# Altium project CathodeControl.PrjPcb
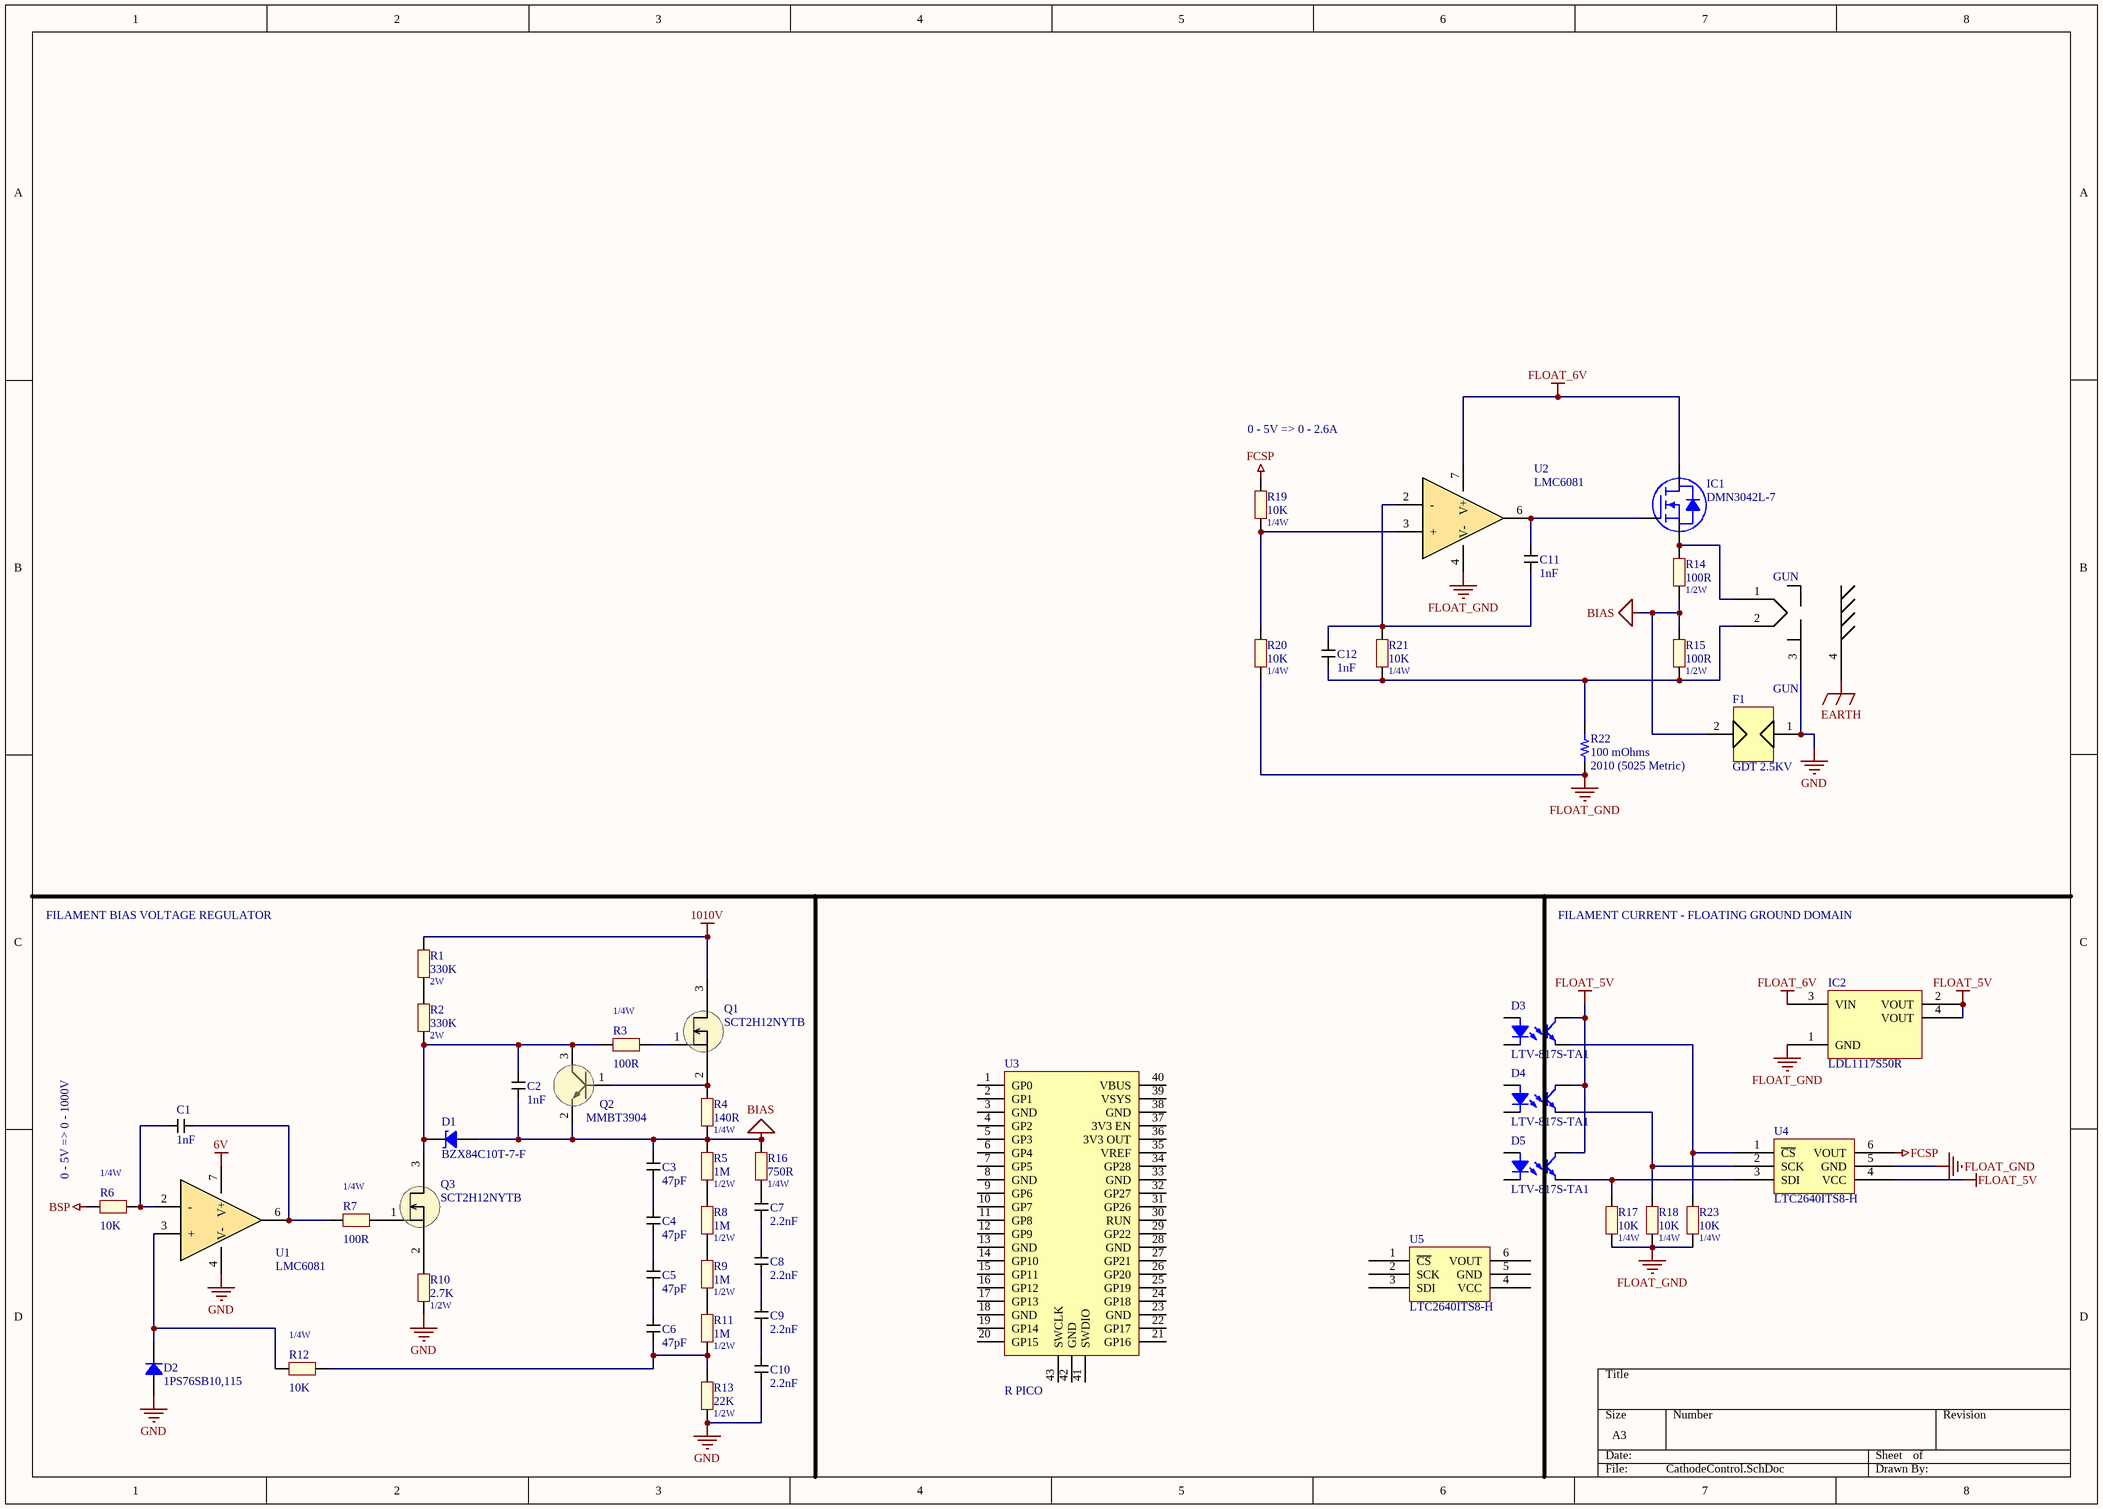
[diagram p0: CathodeControl.SchDoc]
2 sheets, 52 parts. Net scope: global (net labels, ports and power ports of the same name join across sheets).
Board file: CathodeControl.PcbDoc
Sheets:
  CathodeControl.SchDoc
  Simulation.SchDoc

## Sheet CathodeControl.SchDoc
size A3; SheetNumber: 1; SheetTotal: 2

### Parts
C1  1nF  [C0805]
C2  1nF  [C0805]
C3  47pF  [C0805]
C4  47pF  [C0805]
C5  47pF  [C0805]
C6  47pF  [C0805]
C7  2.2nF  [C0805]
C8  2.2nF  [C0805]
C9  2.2nF  [C0805]
C10  2.2nF  [C0805]
C11  1nF  [C0805]
C12  1nF  [C0805]
D1  BZX84C10T-7-F  [DIODES SOT-523]
D2  1PS76SB10,115  [SOD323]
D3  LTV-817S-TA1  [LITEON LTV-817]
D4  LTV-817S-TA1  [LITEON LTV-817]
D5  LTV-817S-TA1  [LITEON LTV-817]
F1  GDT 2.5KV  [GDT]
GUN  GUN
IC1  DMN3042L-7  [DIODES SOT-23-3]
IC2  LDL1117S50R  [ST SOT-223]
Q1  SCT2H12NYTB  [TO-268-2L]
Q2  MMBT3904  [SOT-23-3]
Q3  SCT2H12NYTB  [TO-268-2L]
R1  330K  Power: 2W  [R2512]
R2  330K  Power: 2W  [R2512]
R3  100R  Power: 1/4W  [R0805]
R4  140R  Power: 1/4W  [R0805]
R5  1M  Power: 1/2W  [R1206]
R6  10K  Power: 1/4W  [R0805]
R7  100R  Power: 1/4W  [R0805]
R8  1M  Power: 1/2W  [R1206]
R9  1M  Power: 1/2W  [R1206]
R10  2.7K  Power: 1/2W  [R1206]
R11  1M  Power: 1/2W  [R1206]
R12  10K  Power: 1/4W  [R0805]
R13  22K  Power: 1/2W  [R1206]
R14  100R  Power: 1/2W  [R1206]
R15  100R  Power: 1/2W  [R1206]
R16  750R  Power: 1/4W  [R0805]
R17  10K  Power: 1/4W  [R0805]
R18  10K  Power: 1/4W  [R0805]
R19  10K  Power: 1/4W  [R0805]
R20  10K  Power: 1/4W  [R0805]
R21  10K  Power: 1/4W  [R0805]
R22  100 mOhms  Package / Case: 2010 (5025 Metric)  [STACKPOLE CSR2010]
R23  10K  Power: 1/4W  [R0805]
U1  LMC6081  [SOIC-8]
U2  LMC6081  [SOIC-8]
U3  R PICO  [RPICO]
U4  LTC2640ITS8-H  [SC-70-6]
U5  LTC2640ITS8-H  [SC-70-6]

### Nets
6V: U1.7(V+)
1010V: Q1.3 R1.2
BIAS: C2.1 C3.2 D1.1 F1.2 Q2.2 R4.1 R5.2 R14.1 R15.2 R16.1
BSP: R6.2
EARTH: GUN.4
FCSP: R19.1 U4.6(VOUT)
FLOAT_5V: D3.4 D4.4 D5.4 IC2.2(VOUT) IC2.4(VOUT) U4.4(VCC)
FLOAT_6V: IC1.3(D) IC2.3(VIN) U2.7(V+)
FLOAT_GND: IC2.1(GND) R17.2 R18.2 R20.2 R22.1 R23.2 U2.4(V-) U4.5(GND)
GND: C10.1 D2.1 F1.1 GUN.3 R10.1 R13.1 U1.4(V-)
NetC1_1: C1.1 R7.2 U1.6
NetC1_2: C1.2 R6.1 U1.2(-)
NetC2_2: C2.2 D1.2 Q2.3 Q3.3 R2.1 R3.2
NetC3_1: C3.1 C4.2
NetC4_1: C4.1 C5.2
NetC5_1: C5.1 C6.2
NetC6_1: C6.1 R11.1 R12.1 R13.2
NetC7_1: C7.1 C8.2
NetC7_2: C7.2 R16.2
NetC8_1: C8.1 C9.2
NetC9_1: C9.1 C10.2
NetC11_1: C11.1 IC1.1(G) U2.6
NetC11_2: C11.2 C12.1 R21.1 U2.2(-)
NetC12_2: C12.2 GUN.2 R15.1 R21.2 R22.2
NetD2_2: D2.2 R12.2 U1.3(+)
NetD3_3: D3.3 R23.1 U4.1(~{CS})
NetD4_3: D4.3 R18.1 U4.2(SCK)
NetD5_3: D5.3 R17.1 U4.3(SDI)
NetGUN_1: GUN.1 IC1.2(S) R14.2
NetQ1_1: Q1.1 R3.1
NetQ1_2: Q1.2 Q2.1 R4.2
NetQ3_1: Q3.1 R7.1
NetQ3_2: Q3.2 R10.2
NetR1_1: R1.1 R2.2
NetR5_1: R5.1 R8.2
NetR8_1: R8.1 R9.2
NetR9_1: R9.1 R11.2
NetR19_2: R19.2 R20.1 U2.3(+)

Not connected (* = marked no-connect by the designer): D3 1 2; D4 1 2; D5 1 2; U3 1(GP0) 2(GP1) 3(GND) 4(GP2) 5(GP3) 6(GP4) 7(GP5) 8(GND) 9(GP6) 10(GP7) 11(GP8) 12(GP9) 13(GND) 14(GP10) 15(GP11) 16(GP12) 17(GP13) 18(GND) 19(GP14) 20(GP15) 21(GP16) 22(GP17) 23(GND) 24(GP18) 25(GP19) 26(GP20) 27(GP21) 28(GND) 29(GP22) 30(RUN) 31(GP26) 32(GP27) 33(GND) 34(GP28) 35(VREF) 36(3V3_OUT) 37(3V3_EN) 38(GND) 39(VSYS) 40(VBUS) 41(SWDIO) 42(GND) 43(SWCLK); U5 1(~{CS}) 2(SCK) 3(SDI) 4(VCC) 5(GND) 6(VOUT)

### Notes on the sheet
- 0 - 5V => 0 - 2.6A
- FILAMENT BIAS VOLTAGE REGULATOR
- FILAMENT CURRENT - FLOATING GROUND DOMAIN
- (near R6) 0 - 5V => 0 - 1000V

### Library data of the parts
C1 C2 C7-C12 = C0805
  C1 C2 C11 C12: Capacitance: 1nF
  C7-C10: Capacitance: 2.2nF
C3-C6 = 885342007006: 47 pF ±5% 500V Ceramic Capacitor C0G, NP0 0805 (2012 Metric); Capacitance: 47pF; Supplier 1: Digi-Key; Supplier Part Number 1: 732-12170-1-ND
D1 = BZX84C10T-7-F: DIODE ZENER 10V 150MW SOT523; Manufacturer: Diodes Incorporated; Current - Reverse Leakage @ Vr: 200 nA @ 7 V; Impedance (Max) (Zzt): 20 Ohms; Tolerance: ±6%; Voltage - Forward (Vf) (Max) @ If: 900 mV @ 10 mA; Part Number: BZX84C10T-7-F; ComponentLink1Description: Datasheet; ComponentLink1URL: https://www.diodes.com/assets/Datasheets/ds30262.pdf; ComponentLink2Description: DigiKey Link; ComponentLink2URL: https://www.digikey.com/en/products/detail/diodes-incorporated/BZX84C10T-7-F/1142229; LastUpdated: 4/12/2022 10:53:00 PM; Lifecycle Status: Active; Minimum Order: 1; Mounting Type: Surface Mount; Operating Temperature: -65°C ~ 150°C; Package / Case: SOT-523; Packaging: TapeAndReel; PartId: 778; Part Status: Active; Power - Max: 150 mW; Price: 0.05; Series: -; Supplier 1: DigiKey; Supplier Part Number 1: BZX84C10T-FDICT-ND; Supplier Device Package: SOT-523; Voltage - Zener (Nom) (Vz): 10 V
D2 = 1PS76SB10,115: DIODE SCHOTTKY 30V 200MA SOD323; Manufacturer: Nexperia USA Inc.; Capacitance @ Vr, F: 10pF @ 1V, 1MHz; Current - Average Rectified (Io): 200mA (DC); Current - Reverse Leakage @ Vr: 2 µA @ 25 V; Speed: Small Signal =< 200mA (Io), Any Speed; Voltage - Forward (Vf) (Max) @ If: 800 mV @ 100 mA; Part Number: 1PS76SB10,115; ComponentLink1Description: Datasheet; ComponentLink1URL: https://assets.nexperia.com/documents/data-sheet/1PS76SB10.PDF; ComponentLink2Description: DigiKey Link; ComponentLink2URL: https://www.digikey.com/en/products/detail/nexperia-usa-inc/1PS76SB10-115/1127159; Diode Type: Schottky; LastUpdated: 4/12/2022 11:03:32 PM; Lifecycle Status: Active; Minimum Order: 1; Mounting Type: Surface Mount; Operating Temperature - Junction: 125°C (Max); Package / Case: SC-76, SOD-323; Packaging: TapeAndReel; PartId: 2999; Part Status: Active; Price: 0.03; Series: Automotive, AEC-Q101; Supplier 1: DigiKey; Supplier Part Number 1: 1727-3561-1-ND; Supplier Device Package: SOD-323; Voltage - DC Reverse (Vr) (Max): 30 V
D3-D5 = LTV-817S-TA1: OPTOISOLATR 5KV TRANSISTOR 4-SMD; Manufacturer: Lite-On Inc.; Current - DC Forward (If) (Max): 50mA; Current Transfer Ratio (Max): 600% @ 5mA; Current Transfer Ratio (Min): 50% @ 5mA; Input Type: DC; Number of Channels: 1; Rise / Fall Time (Typ): 4µs, 3µs; Vce Saturation (Max): 200mV; Voltage - Forward (Vf) (Typ): 1.2V; Voltage - Isolation: 5000Vrms; Voltage - Output (Max): 35V; Part Number: LTV-817S-TA1; ComponentLink1Description: Datasheet; ComponentLink1URL: http://optoelectronics.liteon.com/upload/download/DS-70-96-0016/LTV-8X7%20series%20201610%20.pdf; ComponentLink2Description: DigiKey Link; ComponentLink2URL: http://digikey.com/product-detail/en/lite-on-inc/LTV-817S-TA1/160-1893-1-ND/3306757; Current - Output / Channel: 50mA; Device Package: 4-SMD, Gull Wing; LastUpdated: 1/12/2020 9:58:48 PM; Lifecycle Status: Active; Minimum Order: 1; Mounting Type: Surface Mount; Operating Temperature: -30°C ~ 110°C; Output Type: Transistor; Package / Case: 4-SMD, Gull Wing; Packaging: TapeAndReel; Part Status: Active; Price: 0.12; Series: -; Supplier 1: DigiKey; Supplier Part Number 1: 160-1893-1-ND; Supplier Device Package: 4-SMD
F1 = B88069X2500T502: Gas Discharge Tube 2500 V 2000A (2kA) ±20% 2 Pole Through Hole
IC1 = DMN3042L-7: MOSFET N-CH 30V 5.8A SOT23; Manufacturer: Diodes Incorporated; Current - Continuous Drain (Id) @ 25°C: 5.8A (Ta); Drive Voltage (Max Rds On,  Min Rds On): 2.5V, 10V; FET Type: N-Channel; Gate Charge (Qg) (Max) @ Vgs: 20 nC @ 10 V; Input Capacitance (Ciss) (Max) @ Vds: 860 pF @ 15 V; Power Dissipation (Max): 720mW (Ta); Rds On (Max) @ Id, Vgs: 26.5mOhm @ 5.8A, 10V; Vgs (Max): ±12V; Vgs(th) (Max) @ Id: 1.4V @ 250µA; Part Number: DMN3042L-7; ComponentLink1Description: Datasheet; ComponentLink1URL: https://www.diodes.com/assets/Datasheets/DMN3042L.pdf; ComponentLink2Description: DigiKey Link; ComponentLink2URL: https://www.digikey.com/en/products/detail/diodes-incorporated/DMN3042L-7/5223209; Drain to Source Voltage (Vdss): 30 V; LastUpdated: 4/12/2022 11:00:46 PM; Lifecycle Status: Active; Minimum Order: 1; Mounting Type: Surface Mount; Operating Temperature: -55°C ~ 150°C (TJ); Package / Case: TO-236-3, SC-59, SOT-23-3; Packaging: TapeAndReel; Part Status: Active; Price: 0.10; Series: -; Supplier 1: DigiKey; Supplier Part Number 1: DMN3042L-7DICT-ND; Supplier Device Package: SOT-23-3; Technology: MOSFET (Metal Oxide)
IC2 = LDL1117S50R: IC REG LINEAR 5V 1.2A SOT223; Manufacturer: STMicroelectronics; Current - Quiescent (Iq): 500µA; Number of Regulators: 1; Output Configuration: Positive; Output Type: Fixed; Protection Features: Over Current, Over Temperature, Under Voltage Lockout (UVLO); PSRR: 87dB ~ 65dB (120Hz ~ 100kHz); Voltage Dropout (Max): 0.6V @ 1.2A; Voltage - Input (Max): 18V; Part Number: LDL1117S50R; ComponentLink1Description: Datasheet; ComponentLink1URL: http://www.st.com/content/ccc/resource/technical/document/datasheet/group3/0e/5a/00/ca/10/1a/4f/a5/DM00366442/files/DM00366442.pdf/jcr:content/translations/en.DM00366442.pdf; ComponentLink2Description: DigiKey Link; ComponentLink2URL: http://digikey.com/product-detail/en/stmicroelectronics/LDL1117S50R/497-17240-1-ND/7102080; Current - Output: 1.2A; LastUpdated: 4/12/2022 11:08:41 PM; Lifecycle Status: Active; Minimum Order: 1; Mounting Type: Surface Mount; Operating Temperature: -40°C ~ 125°C (TJ); Package / Case: TO-261-4, TO-261AA; Packaging: TapeAndReel; Part Status: Active; Price: 0.12; Series: -; Supplier 1: DigiKey; Supplier Part Number 1: 497-17240-1-ND; Supplier Device Package: SOT-223; Voltage - Output (Min/Fixed): 5V
Q1 Q3 = SCT2H12NYTB: N-MOSFET 1700V 4A; Supplier 1: Digi-Key; Supplier Part Number 1: SCT2H12NYTBTR-ND
Q2 = MMBT3904_1: BIPOLAR NPN Transistor; Supplier 1: Mouser; Supplier 2: Digi-Key; Supplier Part Number 1: 863-MMBT3904LT1G; Supplier Part Number 2: MMBT3904LT1GOSDKR-ND
R1 R2 = R2W: Resistor 2W; Resistance: 330K
R3 R4 R6 R7 R12 R16-R21 R23 = R0.25W: Resistor 1/2W
  R3 R7: Resistance: 100R
  R4: Resistance: 140R
  R6 R12 R17-R21 R23: Resistance: 10K
  R16: Resistance: 750R
R5 R8-R11 R13-R15 = R0.5W: Resistor 1/2W
  R5 R8 R9 R11: Resistance: 1M
  R10: Resistance: 2.7K
  R13: Resistance: 22K
  R14 R15: Resistance: 100R
R22 = ERJ-B1CFR10U: RES 0.1 OHM 2W 2010 WIDE; Manufacturer: Panasonic Electronic Components; Temperature Coefficient: ±100ppm/°C; Tolerance: ±1%; Part Number: ERJ-B1CFR10U; ComponentLink1Description: Datasheet; ComponentLink1URL: http://industrial.panasonic.com/www-cgi/jvcr13pz.cgi?E+PZ+4+AOA0023+ERJB1CFR10U+8+WW; ComponentLink2Description: DigiKey Link; ComponentLink2URL: https://www.digikey.com/en/products/detail/panasonic-electronic-components/ERJ-B1CFR10U/2795283; Composition: Thick Film; Device Package: 2010 (5025 Metric); Features: Automotive AEC-Q200, Current Sense; Height - Seated (Max): 0.030" (0.75mm); LastUpdated: 4/12/2022 10:45:51 PM; Lifecycle Status: Active; Minimum Order: 1; Number of Terminations: 2; Operating Temperature: -55°C ~ 155°C; Packaging: TapeAndReel; PartId: 2967; Part Status: Active; Power (Watts): 2W; Price: 0.59; Ratings: AEC-Q200; Resistance: 100 mOhms; Series: ERJ-B1; Size / Dimension: 0.098" L x 0.197" W (2.50mm x 5.00mm); Supplier 1: DigiKey; Supplier Part Number 1: P18941CT-ND; Supplier Device Package: 1020; Value: 100 mOhms
U1 U2 = LMC6081: Low offset voltage: 150 μV Operates from 4.5V to 15V single supply Ultra low input bias current: 10 fA; Supplier 1: Digi-Key; Supplier Part Number 1: 296-35439-1-ND
U3 = RaspPico
U4 U5 = LTC2640ITS8-HZ12: Supplier 1: Digi-Key; Supplier Part Number 1: LTC2640ITS8-HZ12#TRMPBFCT-ND

## Sheet Simulation.SchDoc
size A; SheetNumber: 2; SheetTotal: 2; SPICEModelCacheDPPIMOKE: <root> / <DocumentId>DPPIMOKE</DocumentId> / <CacheFrame Number="0"> / <Model Name="block_dc_h1_lmc608x" Kind="CKT"> / <Text>* / .SUBCKT BLOCK_DC_H1_LMC608x 1 2 3 4 / H_H1         3 4 VH_H1 1K / VH_H1         1 2 0V / .ENDS  BLOCK_DC_H1_LMC608x</Text> / </Model> / <Model Name="clamp_amp_hi_lmc608x" Kind="CKT"> / <Text>* / .SUBCKT CLAMP_AMP_HI_LMC608x VC+ VC- VIN COM VO+ VO- PARAMS: G=10 / GVO+ COM VO+ VALUE = {IF(V(VIN,COM)&gt;V(VC+,COM),((V(VIN,COM)-V(VC+,COM))*G),0)} / GVO- COM VO- VALUE = {IF(V(VIN,COM)&lt;V(VC-,COM),((V(VC-,COM)-V(VIN,COM))*G),0)} / .ENDS  CLAMP_AMP_HI_LMC608x</Text> / </Model> / <Model Name="block_dc_h2_lmc608x" Kind="CKT"> / <Text>* / .SUBCKT BLOCK_DC_H2_LMC608x 1 2 3 4 / H_H2         3 4 VH_H2 1 / VH_H2         1 2 0V / .ENDS  BLOCK_DC_H2_LMC608x</Text> / </Model> / <Model Name="aol_2_lmc608x" Kind="CKT"> / <Text>* / .SUBCKT AOL_2_LMC608x VC+ VC- IOUT+ IOUT- PARAMS: GAIN=0.011374 IPOS=0.212 INEG=-0.212 / G1 IOUT+ IOUT- VALUE={LIMIT(GAIN*V(VC+,VC-),INEG,IPOS)} / .ENDS  AOL_2_LMC608x</Text> / </Model> / <Model Name="block_dc_h3_lmc608x" Kind="CKT"> / <Text>* / .SUBCKT BLOCK_DC_H3_LMC608x 1 2 3 4 / H_H3         3 4 VH_H3 -1 / VH_H3         1 2 0V / .ENDS  BLOCK_DC_H3_LMC608x</Text> / </Model> / <Model Name="block_dc_s2_lmc608x" Kind="CKT"> / <Text>* / .SUBCKT BLOCK_DC_S2_LMC608x 1 2 3 4 / S_S2         3 4 1 2 _S2 / RS_S2         1 2 1G / .MODEL         _S2 VSWITCH ROFF=1E12 RON=10M VOFF=0.0V VON=10MV / .ENDS  BLOCK_DC_S2_LMC608x</Text> / </Model> / <Model Name="clamp_amp_lo_lmc608x" Kind="CKT"> / <Text>* / .SUBCKT CLAMP_AMP_LO_LMC608x VC+ VC- VIN COM VO+ VO- PARAMS: G=1 / GVO+ COM VO+ VALUE = {IF(V(VIN,COM)&gt;V(VC+,COM),((V(VIN,COM)-V(VC+,COM))*G),0)} / GVO- COM VO- VALUE = {IF(V(VIN,COM)&lt;V(VC-,COM),((V(VC-,COM)-V(VIN,COM))*G),0)} / .ENDS  CLAMP_AMP_LO_LMC608x</Text> / </Model> / <Model Name="aol_1_lmc608x" Kind="CKT"> / <Text>* / .SUBCKT AOL_1_LMC608x VC+ VC- IOUT+ IOUT- PARAMS: GAIN=1E-4 IPOS=.5 INEG=-.5 / G1 IOUT+ IOUT- VALUE={LIMIT(GAIN*V(VC+,VC-),INEG,IPOS)} / .ENDS  AOL_1_LMC608x</Text> / </Model> / <Model Name="sw_ol_lmc608x" Kind="CKT"> / <Text>* / .SUBCKT SW_OL_LMC608x SW_OL_LMC608x MID CAP_L CAP_R / .MODEL OL_SW VSWITCH(RON=1E-3 ROFF=1E12 VON=900E-3 VOFF=800E-3) / S1 CAP_L CAP_R SW_OL_LMC608x MID OL_SW / .ENDS  SW_OL_LMC608x</Text> / </Model> / <Model Name="cl_src_lmc608x" Kind="CKT"> / <Text>* / .SUBCKT CL_SRC_LMC608x VC+ VC- IOUT+ IOUT- PARAMS: GAIN=1 IPOS=0.52E1 INEG=-0.52E1 / G1 IOUT+ IOUT- VALUE={LIMIT(GAIN*V(VC+,VC-),INEG,IPOS)} / .ENDS  CL_SRC_LMC608x</Text> / </Model> / <Model Name="block_dc_s1_lmc608x" Kind="CKT"> / <Text>* / .SUBCKT BLOCK_DC_S1_LMC608x 1 2 3 4 / S_S1         3 4 1 2 _S1 / RS_S1         1 2 1G / .MODEL         _S1 VSWITCH ROFF=1E12 RON=10M VOFF=0.0V VON=10MV / .ENDS  BLOCK_DC_S1_LMC608x</Text> / </Model> / <Model Name="gr_src_lmc608x" Kind="CKT"> / <Text>* / .SUBCKT GR_SRC_LMC608x VC+ VC- IOUT+ IOUT- PARAMS: GAIN=1 IPOS=0.44E1 INEG=-0.44E1 / G1 IOUT+ IOUT- VALUE={LIMIT(GAIN*V(VC+,VC-),INEG,IPOS)} / .ENDS  GR_SRC_LMC608x</Text> / </Model> / <Model Name="vnse_lmc608x" Kind="CKT"> / <Text>* / .SUBCKT VNSE_LMC608x 1 2 PARAMS: FLW=10 GLF=0.1390 RNV=573.05 / .MODEL DVN D KF={PWR(FLW,0.5)/1E11} IS=1.0E-16 / I1 0 7 10E-3 / I2 0 8 10E-3 / D1 7 0 DVN / D2 8 0 DVN / E1 3 6 7 8 {GLF} / R1 3 0 1E9 / R2 3 0 1E9 / R3 3 6 1E9 / E2 6 4 5 0 10 / R4 5 0 {RNV} / R5 5 0 {RNV} / R6 3 4 1E9 / R7 4 0 1E9 / E3 1 2 3 4 1 / .ENDS  VNSE_LMC608x</Text> / </Model> / <Model Name="zo_src_lmc608x" Kind="CKT"> / <Text>* / .SUBCKT ZO_SRC_LMC608x VC+ VC- IOUT+ IOUT- PARAMS: GAIN=526316.2632 IPOS=18E5 INEG=-18E5 / G1 IOUT+ IOUT- VALUE={LIMIT(GAIN*V(VC+,VC-),INEG,IPOS)} / .ENDS  ZO_SRC_LMC608x</Text> / </Model> / <Model Name="ol_sense_lmc608x" Kind="CKT"> / <Text>* / .SUBCKT OL_SENSE_LMC608x COM SW+ OLN OLP / GSW+ COM SW+ VALUE = {IF((V(OLN,COM)&gt;10E-3 | V(OLP,COM)&gt;10E-3),1,0)} / .ENDS  OL_SENSE_LMC608x</Text> / </Model> / <Model Name="clawp_lmc608x" Kind="CKT"> / <Text>* / .SUBCKT CLAWP_LMC608x VC+ VC- IOUT+ IOUT- / G1 IOUT+ IOUT- TABLE {(V(VC+,VC-))} = / +(0.001,   1.00893E-05) / +(46.5,    2.86323E-05) / +(56.6,    6.40164E-05) / +(62,      0.000114368) / +(67.4,    0.000195439) / +(72.9,     0.00034916) / +(79.5,    0.000814877) / +(84.9,     0.00181815) / +(87.6,     0.00310323) / +(89.9,       0.005499) / .ENDS  CLAWP_LMC608x</Text> / </Model> / <Model Name="clawn_lmc608x" Kind="CKT"> / <Text>* / .SUBCKT CLAWN_LMC608x VC+ VC- IOUT+ IOUT- / G1 IOUT+ IOUT- TABLE {(V(VC+,VC-))} = / +(0.388593, 6.76147E-06) / +(41.4735,   1.4135E-05) / +(48.0625,  2.29815E-05) / +(57.7524,  5.32479E-05) / +(67.8298,  0.000161058) / +(75.9692,  0.000446094) / +(82.9459,   0.00129241) / +(86.0467,    0.0022002) / +(87.9846,   0.00374756) / +(89.15,     0.00499624) / .ENDS  CLAWN_LMC608x</Text> / </Model> / <Model Name="esd_out_lmc608x" Kind="CKT"> / <Text>* / .SUBCKT ESD_OUT_LMC608x OUT VCC VEE / .MODEL ESD_SW VSWITCH(RON=50 ROFF=1E12 VON=500E-3 VOFF=450E-3) / S1 OUT VCC OUT VCC ESD_SW / S2 VEE OUT VEE OUT ESD_SW / .ENDS  ESD_OUT_LMC608x</Text> / </Model> / <Model Name="iq_src_lmc608x" Kind="CKT"> / <Text>* / .SUBCKT IQ_SRC_LMC608x VC+ VC- IOUT+ IOUT- PARAMS: GAIN=1E-3 / G1 IOUT+ IOUT- VALUE={IF( (V(VC+,VC-)&lt;=0),0,GAIN*V(VC+,VC-) )} / .ENDS  IQ_SRC_LMC608x</Text> / </Model> / <Model Name="claw_src_lmc608x" Kind="CKT"> / <Text>* / .SUBCKT CLAW_SRC_LMC608x VC+ VC- IOUT+ IOUT- PARAMS: GAIN=1 IPOS=0.26E1 INEG=-0.26E1 / G1 IOUT+ IOUT- VALUE={LIMIT(GAIN*V(VC+,VC-),INEG,IPOS)} / .ENDS  CLAW_SRC_LMC608x</Text> / </Model> / <Model Name="femt_lmc608x" Kind="CKT"> / <Text>* / .SUBCKT FEMT_LMC608x 1 2 PARAMS: NVRF=0.08 / E1 3 0 5 0 10 / R1 5 0 {1.184*PWR(NVRF,2)} / R2 5 0 {1.184*PWR(NVRF,2)} / G1 1 2 3 0 1E-6 / .ENDS  FEMT_LMC608x</Text> / </Model> / <Model Name="vos_drift_lmc608x" Kind="CKT"> / <Text>* / .SUBCKT VOS_DRIFT_LMC608x VOS+ VOS- PARAMS: DC=-159.11E-6 POL=1 DRIFT=1.00E-06 / E1 VOS+ VOS- VALUE={DC+POL*DRIFT*(TEMP-27)} / .ENDS  VOS_DRIFT_LMC608x</Text> / </Model> / <Model Name="esd_in_lmc608x" Kind="CKT"> / <Text>* / .SUBCKT ESD_IN_LMC608x ESDN ESDP VCC VEE / .MODEL ESD_SW VSWITCH(RON=50 ROFF=1E12 VON=500E-3 VOFF=450E-3) / S1 ESDN VCC ESDN VCC ESD_SW / S2 ESDP VCC ESDP VCC ESD_SW / S3 VEE ESDN VEE ESDN ESD_SW / S4 VEE ESDP VEE ESDP ESD_SW / .ENDS  ESD_IN_LMC608x</Text> / </Model> / <Model Name="vcm_clamp_lmc608x" Kind="CKT"> / <Text>* / .SUBCKT VCM_CLAMP_LMC608x VIN+ VIN- IOUT- IOUT+ VP+ VP- PARAMS: GAIN=1 / G1 IOUT+ IOUT- VALUE={LIMIT(GAIN*V(VIN+,VIN-),V(VP-,VIN-), V(VP+,VIN-))} / .ENDS  VCM_CLAMP_LMC608x</Text> / </Model> / <Model Name="lmc608x" Kind="CKT"> / <Text>*$ / * LMC608x / ***************************************************************************** / * (C) Copyright 2021 Texas Instruments Incorporated. All rights reserved. / ***************************************************************************** / ** This model is designed as an aid for customers of Texas Instruments. / ** TI and its licensors and suppliers make no warranties, either expressed / ** or implied, with respect to this model, including the warranties of / ** merchantability or fitness for a particular purpose.  The model is / ** provided solely on an "as is" basis.  The entire risk as to its quality / ** and performance is with the customer / ***************************************************************************** / * / * This model is subject to change without notice. Texas Instruments / * Incorporated is not responsible for updating this model. / * / ***************************************************************************** / * / ** Released by: Online Design Tools, Texas Instruments Inc. / * Part: LMC608x / * Date: 30DEC2021 / * Model Type: Generic (suitable for all analysis types) / * EVM Order Number: N/A / * EVM Users Guide:  N/A / * Datasheet: SNOS649C -AUGUST 2000-REVISED MARCH 2013 / * Created with Green-Williams-Lis Op Amp Macro-model Architecture / * / * Model Version: Final 1.2 / * / ***************************************************************************** / * / * Updates: / * / * Final 1.2 / * 1. Modified the capacitor(C14) value from 1F to 1uF in GND Float-IQ block / *    to resolve the convergence issue in single and asymmetric supply test. / * 2. Updated Zo block to resolve the bump in Aol curve at lower frequency. / * 3. Updated Aol DC Gain. / * 4. Updated IQ current as per the datasheet. / * 5. Updated the model name from LMC6081 to LMC608x. / * / * Final 1.1 / * Updated with unique subckt name, vos drift and edits in claw block / * / * Final 1.0 / * Release to Web. / * / ***************************************************************************** / * Model Usage Notes: / * 1. The following parameters are modeled: / *    a. OPEN-LOOP GAIN AND PHASE VS. FREQUENCY  WITH RL, CL EFFECTS (Aol) / *    b. UNITY GAIN BANDWIDTH (GBW) / *    c. INPUT COMMON-MODE REJECTION RATIO VS. FREQUENCY (CMRR) / *    d. POWER SUPPLY REJECTION RATIO VS. FREQUENCY (PSRR) / *    e. DIFFERENTIAL INPUT IMPEDANCE (Zid) / *    f. COMMON-MODE INPUT IMPEDANCE (Zic) / *    g. OPEN-LOOP OUTPUT IMPEDANCE VS. FREQUENCY (Zo) / *    h. OUTPUT CURRENT THROUGH THE SUPPLY (Iout) / *    i. INPUT VOLTAGE NOISE DENSITY VS. FREQUENCY (en) / *    j. INPUT CURRENT NOISE DENSITY VS. FREQUENCY (in) / *    k. OUTPUT VOLTAGE SWING vs. OUTPUT CURRENT (Vo) / *    l. SHORT-CIRCUIT OUTPUT CURRENT (Isc) / *    m. QUIESCENT CURRENT (Iq) / *    n. SETTLING TIME VS. CAPACITIVE LOAD (ts) / *    o. SLEW RATE (SR) / *    p. SMALL SIGNAL OVERSHOOT VS. CAPACITIVE LOAD / *    q. LARGE SIGNAL RESPONSE / *    r. OVERLOAD RECOVERY TIME (tor) / *    s. INPUT BIAS CURRENT (Ib) / *    t. INPUT OFFSET CURRENT (Ios) / *    u. INPUT OFFSET VOLTAGE (Vos) / *    v. INPUT OFFSET VOLTAGE VS. TEMPERATURE (Vos Drift) / *    w. INPUT COMMON-MODE VOLTAGE RANGE (Vcm) / *    x. INPUT OFFSET VOLTAGE VS. INPUT COMMON-MODE VOLTAGE (Vos vs. Vcm) / *    y. INPUT/OUTPUT ESD CELLS (ESDin, ESDout) / ***************************************************************************** / .SUBCKT LMC608x IN+ IN- VCC VEE OUT / ***************************************************************************** / C_C1          N3294772 N3294776  503.26F / C_C10         N3294626 N3294630  14.47U / C_C104        N3294524 MID  3.1831F / C_C110        N4589665 N2991581  159.15F / C_C119        N4654077 N2991553  19.894F / C_C120        N4660141 N2991579  21.359P / C_C13         N2992397 0  1F / C_C14         0 N2992375  1U / C_C15         N2992413 0  1F / C_C16         N2991741 MID  1F / C_C17         N2991765 MID  1F / C_C18         N2991811 MID  1F / C_C19         N2991831 MID  1F / C_C20         N2991907 MID  1F / C_C21         N2991925 MID  1F / C_C22         MID N2991969  1F / C_C23         N2992033 MID  1F / C_C24         N2992029 MID  1F / C_C25         N2992093 MID  1P / C_C26         N2992099 MID  1P / C_C27         SW_OL_LMC608x MID  100P / C_C29         VIMON MID  1N / C_C30         VOUT_S MID  1N / C_C4          N2991657 MID  1F / C_C5          CLAMP MID  125.8N / C_C70         VCLP MID  100P / C_C72         N4031911 MID  48.971F / C_C74         N3201092 N3828449  1.5915P / C_C77         N3850714 N3850724  1.061P / C_C93         N4243633 N4243623  397.89P / C_C94         N4282914 MID  34.616F / C_C95         N4283497 MID  3.1433F / C_C_COM0      ESDP MID  5P / C_C_COM1      MID ESDN  5P / C_C_DIFF      ESDN ESDP  5P / E_E1          MID 0 N2992375 0 1 / E_E3          N2992163 MID OUT MID 1 / E_E4          N3294618 MID CL_CLAMP MID 1 / G_G1          N3294772 MID ESDP MID -11.826M / G_G12         CLAW_CLAMP MID N3294524 MID -1M / G_G13         CL_CLAMP MID CLAW_CLAMP MID -1M / G_G16         N3201092 MID N3294630 MID -6.6 / G_G18         VCC_B 0 VCC 0 -1 / G_G19         VEE_B 0 VEE 0 -1 / G_G2          N2991563 N2991555 N2991553 MID -1M / G_G20         VCC_CLP MID N2992033 MID -1M / G_G21         VEE_CLP MID N2992029 MID -1M / G_G22         N2992299 MID N2992295 MID -1 / G_G23         N2992323 MID N2992331 MID -1 / G_G39         N3294626 MID CL_CLAMP N2992235 -89.047 / G_G4          N3850714 MID VCC_B MID -11.888M / G_G41         N4031911 MID VSENSE MID -1U / G_G5          N2991587 N2991583 N2991581 N2991579 -1M / G_G6          VSENSE MID CLAMP MID -1M / G_G63         N4243633 MID VEE_B MID -42.802U / G_G64         N4282914 MID N4031911 MID -1U / G_G65         N4283497 MID N4282914 MID -1U / G_G75         N3294524 MID N4283497 MID -1U / G_G81         N4589665 MID N3850724 MID -90 / G_G90         N4654077 MID N3294776 MID -25.5 / G_G91         N4660141 MID N4243623 MID -13.420148K / I_I_B         N2991573 MID DC 10.01F / I_I_OS        ESDN MID DC 4.56F / I_I_Q         VCC VEE DC 550U / R_R15         N2991583 N2991563 R_NOISELESS 1M / R_R16         N2991587 N2991583 R_NOISELESS 1K / R_R167        N3294618 VCLP R_NOISELESS 100 / R_R17         N2991619 ESDN R_NOISELESS 1M / R_R171        MID N4031911 R_NOISELESS 1MEG / R_R176        MID N3201092 R_NOISELESS 1 / R_R178        N3828449 N3201092 R_NOISELESS 10K / R_R179        MID N3828449 R_NOISELESS 19M / R_R18         MID N2991623 R_NOISELESS 1T / R_R187        N3850724 N3850714 R_NOISELESS 100MEG / R_R189        MID N3850714 R_NOISELESS 1 / R_R19         MID N2991635 R_NOISELESS 1T / R_R190        MID N3850724 R_NOISELESS 166.944908K / R_R20         N2991643 MID R_NOISELESS 1 / R_R21         N2991657 N2991643 R_NOISELESS 1M / R_R22         MID N2991667 R_NOISELESS 1MEG / R_R23         MID CLAMP R_NOISELESS 1MEG / R_R230        N4243623 N4243633 R_NOISELESS 100MEG / R_R233        MID N4243623 R_NOISELESS 100MEG / R_R234        MID N4243633 R_NOISELESS 1 / R_R235        MID N4282914 R_NOISELESS 1MEG / R_R236        MID N4283497 R_NOISELESS 1MEG / R_R24         MID VSENSE R_NOISELESS 1K / R_R260        MID N3294524 R_NOISELESS 1MEG / R_R272        N2991581 N4589665 R_NOISELESS 100MEG / R_R273        MID N2991581 R_NOISELESS 1.123596MEG / R_R274        MID N4589665 R_NOISELESS 1 / R_R295        N2991553 N4654077 R_NOISELESS 100MEG / R_R296        MID N4654077 R_NOISELESS 1 / R_R297        MID N2991553 R_NOISELESS 4.166667MEG / R_R298        N2991579 N4660141 R_NOISELESS 100MEG / R_R299        MID N4660141 R_NOISELESS 1 / R_R300        MID N2991579 R_NOISELESS 7.452038K / R_R32         MID CLAW_CLAMP R_NOISELESS 1K / R_R33         MID CL_CLAMP R_NOISELESS 1K / R_R34         N3294630 N3294626 R_NOISELESS 10K / R_R35         MID N3294626 R_NOISELESS 1 / R_R36         MID N3294630 R_NOISELESS 1.786K / R_R43         MID N3294682 R_NOISELESS 1 / R_R46         VCC_B 0 R_NOISELESS 1 / R_R47         VCC_B N2992397 R_NOISELESS 1M / R_R48         N2992397 N2992375 R_NOISELESS 1MEG / R_R49         N2992375 0 R_NOISELESS 1T / R_R5          MID N3294772 R_NOISELESS 1 / R_R50         N2992375 N2992413 R_NOISELESS 1MEG / R_R51         N2992413 VEE_B R_NOISELESS 1M / R_R52         VEE_B 0 R_NOISELESS 1 / R_R53         VCC_CLP MID R_NOISELESS 1T / R_R54         N2991729 MID R_NOISELESS 1 / R_R55         N2991741 N2991729 R_NOISELESS 1M / R_R56         VEE_CLP MID R_NOISELESS 1T / R_R57         N2991763 MID R_NOISELESS 1 / R_R58         N2991765 N2991763 R_NOISELESS 1M / R_R59         N2991807 MID R_NOISELESS 1T / R_R6          N3294776 N3294772 R_NOISELESS 100MEG / R_R60         N2991809 MID R_NOISELESS 1 / R_R61         N2991811 N2991809 R_NOISELESS 1M / R_R62         N2991831 N2991837 R_NOISELESS 1M / R_R63         N2991849 MID R_NOISELESS 1T / R_R64         N2991837 MID R_NOISELESS 1 / R_R65         N2991901 MID R_NOISELESS 1T / R_R66         N2991905 MID R_NOISELESS 1 / R_R67         N2991907 N2991905 R_NOISELESS 1M / R_R68         N2991925 N2991931 R_NOISELESS 1M / R_R69         N2991943 MID R_NOISELESS 1T / R_R7          MID N3294776 R_NOISELESS 211.275649K / R_R70         N2991931 MID R_NOISELESS 1 / R_R71         N2991969 VSENSE R_NOISELESS 1M / R_R72         VCC_B N2991997 R_NOISELESS 1K / R_R73         N2991997 N2992033 R_NOISELESS 1M / R_R74         N2992001 VEE_B R_NOISELESS 1K / R_R75         N2992001 N2992029 R_NOISELESS 1M / R_R76         MID VCC_CLP R_NOISELESS 1K / R_R77         VEE_CLP MID R_NOISELESS 1K / R_R78         N2992323 MID R_NOISELESS 1 / R_R79         N2992299 MID R_NOISELESS 1 / R_R8          N2991563 N2991555 R_NOISELESS 1K / R_R80         V11 N2992093 R_NOISELESS 100 / R_R81         V12 N2992099 R_NOISELESS 100 / R_R82         N2992105 MID R_NOISELESS 1 / R_R83         N2992105 SW_OL_LMC608x R_NOISELESS 100 / R_RDUMMY      MID N2992235 R_NOISELESS 10K / R_RS_INN      IN- ESDN R_NOISELESS 10M / R_RS_INP      IN+ ESDP R_NOISELESS 10M / R_RX          N2992235 N3294682 R_NOISELESS 100K / R_RX1         MID N2992151 R_NOISELESS 1T / R_RX2         VIMON N2992151 R_NOISELESS 100 / R_RX3         MID N2992163 R_NOISELESS 1T / R_RX4         VOUT_S N2992163 R_NOISELESS 100 / R_R_CM1       ESDP MID R_NOISELESS 1T / R_R_CM2       MID ESDN R_NOISELESS 1T / V_VCM_MAX     N2991623 VCC_B -2.3 / V_VCM_MIN     N2991635 VEE_B -100M / V_V_GRN       N2991943 MID -130 / V_V_GRP       N2991901 MID 130 / V_V_ISCN      N2991849 MID -89.15 / V_V_ISCP      N2991807 MID 89.9 / V_V_ORN       N2992295 VCLP -1.52 / V_V_ORP       N2992331 VCLP 1.52 / X_H1          N2992235 OUT N2992151 MID BLOCK_DC_H1_LMC608x / X_H2          N2992287 N2992323 V12 MID BLOCK_DC_H2_LMC608x / X_H3          N2992267 N2992299 V11 MID BLOCK_DC_H3_LMC608x / X_S1          N2992267 CLAMP N2992267 CLAMP BLOCK_DC_S1_LMC608x / X_S2          CLAMP N2992287 CLAMP N2992287 BLOCK_DC_S2_LMC608x / X_U1          ESDP N2991573 VNSE_LMC608x PARAMS: FLW=10 GLF=0.1390 RNV=573.05 / X_U10         VCC_CLP VEE_CLP VOUT_S MID N2991729 N2991763 CLAMP_AMP_LO_LMC608x PARAMS: / +  G=1 / X_U11         N2991807 N2991849 VIMON MID N2991809 N2991837 CLAMP_AMP_LO_LMC608x / +  PARAMS: G=1 / X_U12         N2991901 N2991943 N2991969 MID N2991905 N2991931 CLAMP_AMP_HI_LMC608x / +  PARAMS: G=10 / X_U16         MID N2992105 N2992093 N2992099 OL_SENSE_LMC608x / X_U18         VIMON MID N2991997 VCC_B CLAWP_LMC608x / X_U19         MID VIMON VEE_B N2992001 CLAWN_LMC608x / X_U21         OUT VCC VEE ESD_OUT_LMC608x / X_U22         N2991811 N2991831 CL_CLAMP MID CL_SRC_LMC608x PARAMS: GAIN=1 IPOS=0.52E1 / +  INEG=-0.52E1 / X_U23         N2991907 N2991925 CLAMP MID GR_SRC_LMC608x PARAMS: GAIN=1 IPOS=0.44E1 / +  INEG=-0.44E1 / X_U25         SW_OL_LMC608x MID N3294626 N3294630 SW_OL_LMC608x PARAMS: / X_U26         VIMON MID VCC MID IQ_SRC_LMC608x PARAMS: GAIN=1E-3 / X_U27         MID VIMON MID VEE IQ_SRC_LMC608x PARAMS: GAIN=1E-3 / X_U30         N2991657 N2991619 MID N2991667 AOL_1_LMC608x PARAMS: GAIN=1E-4 IPOS=.5 / +  INEG=-.5 / X_U31         N2991667 MID MID CLAMP AOL_2_LMC608x PARAMS: GAIN=0.011374 IPOS=0.212 / +  INEG=-0.212 / X_U32         N3828449 MID MID N3294682 ZO_SRC_LMC608x PARAMS: GAIN=526316.2632 / +  IPOS=18E5 INEG=-18E5 / X_U35         N2991741 N2991765 CLAW_CLAMP MID CLAW_SRC_LMC608x PARAMS: GAIN=1 / +  IPOS=0.26E1 INEG=-0.26E1 / X_U38         MID N2991573 FEMT_LMC608x PARAMS: NVRF=0.08 / X_U39         ESDN MID FEMT_LMC608x PARAMS: NVRF=0.08 / X_U4          N2991555 N2991573 VOS_DRIFT_LMC608x PARAMS: DC=-159.11E-6 POL=1 / +  DRIFT=1.00E-06 / X_U5          ESDN ESDP VCC VEE ESD_IN_LMC608x / X_U6          N2991587 MID N2991643 MID N2991623 N2991635 VCM_CLAMP_LMC608x PARAMS: / +  GAIN=1 / .ENDS LMC608x</Text> / <Dependency>0\block_dc_h1_lmc608x</Dependency> / <Dependency>0\clamp_amp_hi_lmc608x</Dependency> / <Dependency>0\block_dc_h2_lmc608x</Dependency> / <Dependency>0\aol_2_lmc608x</Dependency> / <Dependency>0\block_dc_h3_lmc608x</Dependency> / <Dependency>0\block_dc_s2_lmc608x</Dependency> / <Dependency>0\clamp_amp_lo_lmc608x</Dependency> / <Dependency>0\aol_1_lmc608x</Dependency> / <Dependency>0\sw_ol_lmc608x</Dependency> / <Dependency>0\cl_src_lmc608x</Dependency> / <Dependency>0\block_dc_s1_lmc608x</Dependency> / <Dependency>0\gr_src_lmc608x</Dependency> / <Dependency>0\vnse_lmc608x</Dependency> / <Dependency>0\zo_src_lmc608x</Dependency> / <Dependency>0\ol_sense_lmc608x</Dependency> / <Dependency>0\clawp_lmc608x</Dependency> / <Dependency>0\clawn_lmc608x</Dependency> / <Dependency>0\esd_out_lmc608x</Dependency> / <Dependency>0\iq_src_lmc608x</Dependency> / <Dependency>0\claw_src_lmc608x</Dependency> / <Dependency>0\femt_lmc608x</Dependency> / <Dependency>0\vos_drift_lmc608x</Dependency> / <Dependency>0\esd_in_lmc608x</Dependency> / <Dependency>0\vcm_clamp_lmc608x</Dependency> / </Model> / </CacheFrame> / </root>